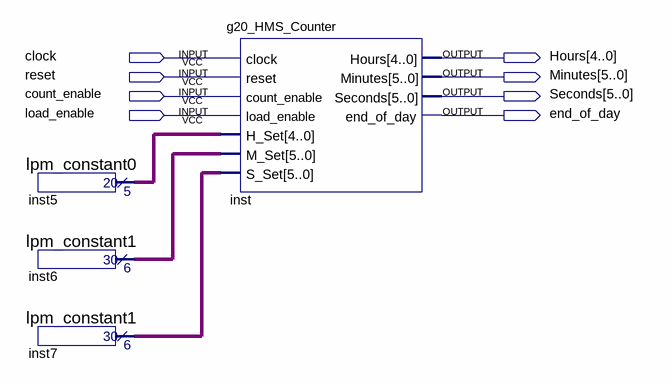
[diagram p0: schematic sheet]
// Quartus schematic HMS_Counter.bdf as structural Verilog: 4 symbols, 8 pins
module HMS_Counter (
  input  clock,
  input  reset,
  input  count_enable,
  input  load_enable,
  output [4:0] Hours,
  output [5:0] Minutes,
  output [5:0] Seconds,
  output end_of_day
);

  wire [4:0] inst5_result;
  wire [5:0] inst6_result, inst7_result;

  lpm_constant0 inst5 (.result(inst5_result));
  lpm_constant1 inst6 (.result(inst6_result));
  lpm_constant1 inst7 (.result(inst7_result));
  g20_HMS_Counter inst (
    .clock(clock), .reset(reset), .count_enable(count_enable), .load_enable(load_enable),
    .H_Set(inst5_result), .M_Set(inst6_result), .S_Set(inst7_result), .Hours(Hours), .Minutes(Minutes),
    .Seconds(Seconds), .end_of_day(end_of_day));
endmodule
